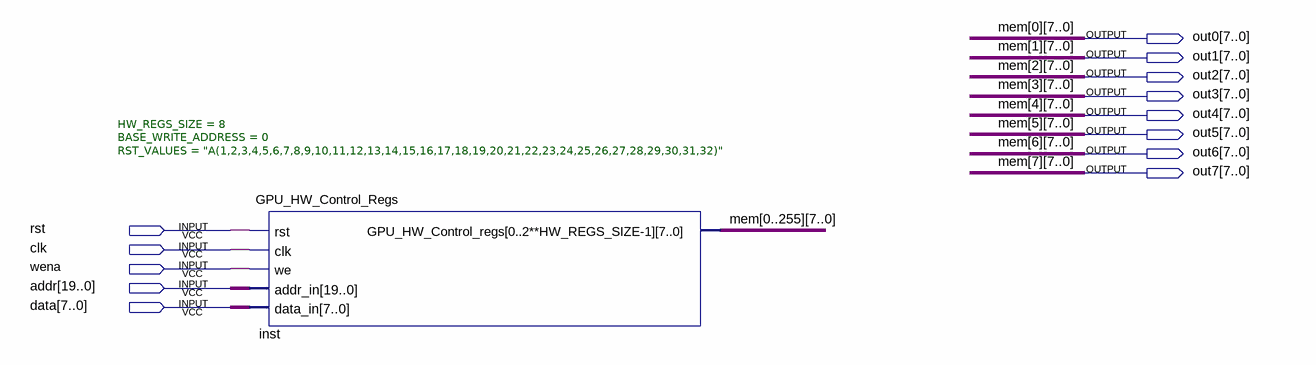
[diagram p0: schematic sheet]
// Quartus schematic REGISTER_BANK.bdf as structural Verilog: 1 symbols, 13 pins
module REGISTER_BANK (
  input  rst,
  input  clk,
  input  wena,
  input  [19:0] addr,
  input  [7:0] data,
  output [7:0] out0,
  output [7:0] out1,
  output [7:0] out2,
  output [7:0] out3,
  output [7:0] out4,
  output [7:0] out5,
  output [7:0] out6,
  output [7:0] out7
);

  wire [7:0] mem_8, mem_9, mem_10, mem_11, mem_12, mem_13, mem_14, mem_15, mem_16, mem_17, mem_18, mem_19,
       mem_20, mem_21, mem_22, mem_23, mem_24, mem_25, mem_26, mem_27, mem_28, mem_29, mem_30, mem_31,
       mem_32, mem_33, mem_34, mem_35, mem_36, mem_37, mem_38, mem_39, mem_40, mem_41, mem_42, mem_43,
       mem_44, mem_45, mem_46, mem_47, mem_48, mem_49, mem_50, mem_51, mem_52, mem_53, mem_54, mem_55,
       mem_56, mem_57, mem_58, mem_59, mem_60, mem_61, mem_62, mem_63, mem_64, mem_65, mem_66, mem_67,
       mem_68, mem_69, mem_70, mem_71, mem_72, mem_73, mem_74, mem_75, mem_76, mem_77, mem_78, mem_79,
       mem_80, mem_81, mem_82, mem_83, mem_84, mem_85, mem_86, mem_87, mem_88, mem_89, mem_90, mem_91,
       mem_92, mem_93, mem_94, mem_95, mem_96, mem_97, mem_98, mem_99, mem_100, mem_101, mem_102, mem_103,
       mem_104, mem_105, mem_106, mem_107, mem_108, mem_109, mem_110, mem_111, mem_112, mem_113, mem_114,
       mem_115, mem_116, mem_117, mem_118, mem_119, mem_120, mem_121, mem_122, mem_123, mem_124, mem_125,
       mem_126, mem_127, mem_128, mem_129, mem_130, mem_131, mem_132, mem_133, mem_134, mem_135, mem_136,
       mem_137, mem_138, mem_139, mem_140, mem_141, mem_142, mem_143, mem_144, mem_145, mem_146, mem_147,
       mem_148, mem_149, mem_150, mem_151, mem_152, mem_153, mem_154, mem_155, mem_156, mem_157, mem_158,
       mem_159, mem_160, mem_161, mem_162, mem_163, mem_164, mem_165, mem_166, mem_167, mem_168, mem_169,
       mem_170, mem_171, mem_172, mem_173, mem_174, mem_175, mem_176, mem_177, mem_178, mem_179, mem_180,
       mem_181, mem_182, mem_183, mem_184, mem_185, mem_186, mem_187, mem_188, mem_189, mem_190, mem_191,
       mem_192, mem_193, mem_194, mem_195, mem_196, mem_197, mem_198, mem_199, mem_200, mem_201, mem_202,
       mem_203, mem_204, mem_205, mem_206, mem_207, mem_208, mem_209, mem_210, mem_211, mem_212, mem_213,
       mem_214, mem_215, mem_216, mem_217, mem_218, mem_219, mem_220, mem_221, mem_222, mem_223, mem_224,
       mem_225, mem_226, mem_227, mem_228, mem_229, mem_230, mem_231, mem_232, mem_233, mem_234, mem_235,
       mem_236, mem_237, mem_238, mem_239, mem_240, mem_241, mem_242, mem_243, mem_244, mem_245, mem_246,
       mem_247, mem_248, mem_249, mem_250, mem_251, mem_252, mem_253, mem_254, mem_255;

  GPU_HW_Control_Regs #(.HW_REGS_SIZE(8), .BASE_WRITE_ADDRESS(0), .RST_VALUES("A(1,2,3,4,5,6,7,8,9,10,11,12,13,14,15,16,17,18,19,20,21,22,23,24,25,26,27,28,29,30,31,32)")) inst (
    .rst(rst), .clk(clk), .we(wena), .addr_in(addr), .data_in(data),
    .GPU_HW_Control_regs({out0, out1, out2, out3, out4, out5, out6, out7, mem_8, mem_9, mem_10, mem_11, mem_12, mem_13, mem_14, mem_15, mem_16, mem_17, mem_18, mem_19, mem_20, mem_21, mem_22, mem_23, mem_24, mem_25, mem_26, mem_27, mem_28, mem_29, mem_30, mem_31, mem_32, mem_33, mem_34, mem_35, mem_36, mem_37, mem_38, mem_39, mem_40, mem_41, mem_42, mem_43, mem_44, mem_45, mem_46, mem_47, mem_48, mem_49, mem_50, mem_51, mem_52, mem_53, mem_54, mem_55, mem_56, mem_57, mem_58, mem_59, mem_60, mem_61, mem_62, mem_63, mem_64, mem_65, mem_66, mem_67, mem_68, mem_69, mem_70, mem_71, mem_72, mem_73, mem_74, mem_75, mem_76, mem_77, mem_78, mem_79, mem_80, mem_81, mem_82, mem_83, mem_84, mem_85, mem_86, mem_87, mem_88, mem_89, mem_90, mem_91, mem_92, mem_93, mem_94, mem_95, mem_96, mem_97, mem_98, mem_99, mem_100, mem_101, mem_102, mem_103, mem_104, mem_105, mem_106, mem_107, mem_108, mem_109, mem_110, mem_111, mem_112, mem_113, mem_114, mem_115, mem_116, mem_117, mem_118, mem_119, mem_120, mem_121, mem_122, mem_123, mem_124, mem_125, mem_126, mem_127, mem_128, mem_129, mem_130, mem_131, mem_132, mem_133, mem_134, mem_135, mem_136, mem_137, mem_138, mem_139, mem_140, mem_141, mem_142, mem_143, mem_144, mem_145, mem_146, mem_147, mem_148, mem_149, mem_150, mem_151, mem_152, mem_153, mem_154, mem_155, mem_156, mem_157, mem_158, mem_159, mem_160, mem_161, mem_162, mem_163, mem_164, mem_165, mem_166, mem_167, mem_168, mem_169, mem_170, mem_171, mem_172, mem_173, mem_174, mem_175, mem_176, mem_177, mem_178, mem_179, mem_180, mem_181, mem_182, mem_183, mem_184, mem_185, mem_186, mem_187, mem_188, mem_189, mem_190, mem_191, mem_192, mem_193, mem_194, mem_195, mem_196, mem_197, mem_198, mem_199, mem_200, mem_201, mem_202, mem_203, mem_204, mem_205, mem_206, mem_207, mem_208, mem_209, mem_210, mem_211, mem_212, mem_213, mem_214, mem_215, mem_216, mem_217, mem_218, mem_219, mem_220, mem_221, mem_222, mem_223, mem_224, mem_225, mem_226, mem_227, mem_228, mem_229, mem_230, mem_231, mem_232, mem_233, mem_234, mem_235, mem_236, mem_237, mem_238, mem_239, mem_240, mem_241, mem_242, mem_243, mem_244, mem_245, mem_246, mem_247, mem_248, mem_249, mem_250, mem_251, mem_252, mem_253, mem_254, mem_255}));

  // Other names for the same wires on the sheet: mem_0[7:0] = out0; mem_1[7:0] = out1; mem_2[7:0] = out2;
  //   mem_3[7:0] = out3; mem_4[7:0] = out4; mem_5[7:0] = out5; mem_6[7:0] = out6; mem_7[7:0] = out7
endmodule
